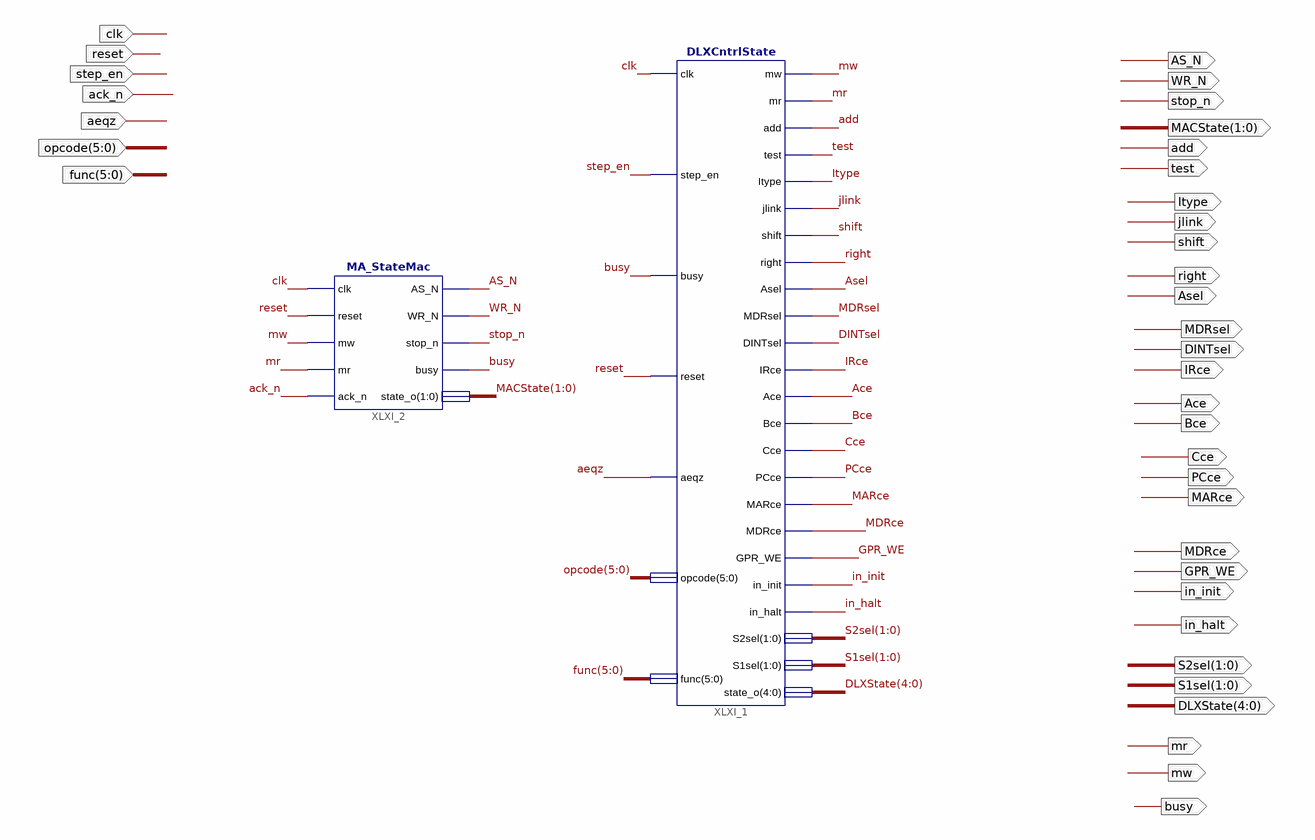
[diagram p0: schematic sheet 1]
// Xilinx ISE schematic DLXControlTop.sch (spartan6) as structural Verilog: 2 symbols, 36 ports
module DLXControlTop (
  input  clk,
  input  reset,
  input  step_en,
  input  ack_n,
  input  aeqz,
  input  [5:0] opcode,
  input  [5:0] func,
  output mw,
  output WR_N,
  output [1:0] MACState,
  output busy,
  output mr,
  output add,
  output test,
  output Itype,
  output jlink,
  output right,
  output Asel,
  output MDRsel,
  output DINTsel,
  output IRce,
  output Ace,
  output Bce,
  output Cce,
  output PCce,
  output MARce,
  output MDRce,
  output GPR_WE,
  output in_init,
  output in_halt,
  output [4:0] DLXState,
  output AS_N,
  output stop_n,
  output shift,
  output [1:0] S2sel,
  output [1:0] S1sel
);

  DLXCntrlState XLXI_1 (
    .clk(clk), .step_en(step_en), .busy(busy), .reset(reset), .aeqz(aeqz), .opcode(opcode), .func(func),
    .mw(mw), .mr(mr), .add(add), .test(test), .Itype(Itype), .jlink(jlink), .shift(shift), .right(right),
    .Asel(Asel), .MDRsel(MDRsel), .DINTsel(DINTsel), .IRce(IRce), .Ace(Ace), .Bce(Bce), .Cce(Cce),
    .PCce(PCce), .MARce(MARce), .MDRce(MDRce), .GPR_WE(GPR_WE), .in_init(in_init), .in_halt(in_halt),
    .S2sel(S2sel), .S1sel(S1sel), .state_o(DLXState));
  MA_StateMac XLXI_2 (
    .clk(clk), .reset(reset), .mw(mw), .mr(mr), .ack_n(ack_n), .AS_N(AS_N), .WR_N(WR_N), .stop_n(stop_n),
    .busy(busy), .state_o(MACState));
endmodule
